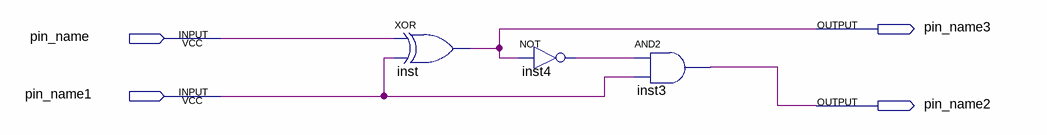
[diagram p0: schematic sheet]
// Quartus schematic halfadd.bdf as structural Verilog: 3 symbols, 4 pins
module halfadd (
  input  pin_name,
  input  pin_name1,
  output pin_name3,
  output pin_name2
);

  wire inst4_out;

  xor inst (pin_name3, pin_name, pin_name1);
  not inst4 (inst4_out, pin_name3);
  and inst3 (pin_name2, inst4_out, pin_name1);
endmodule
